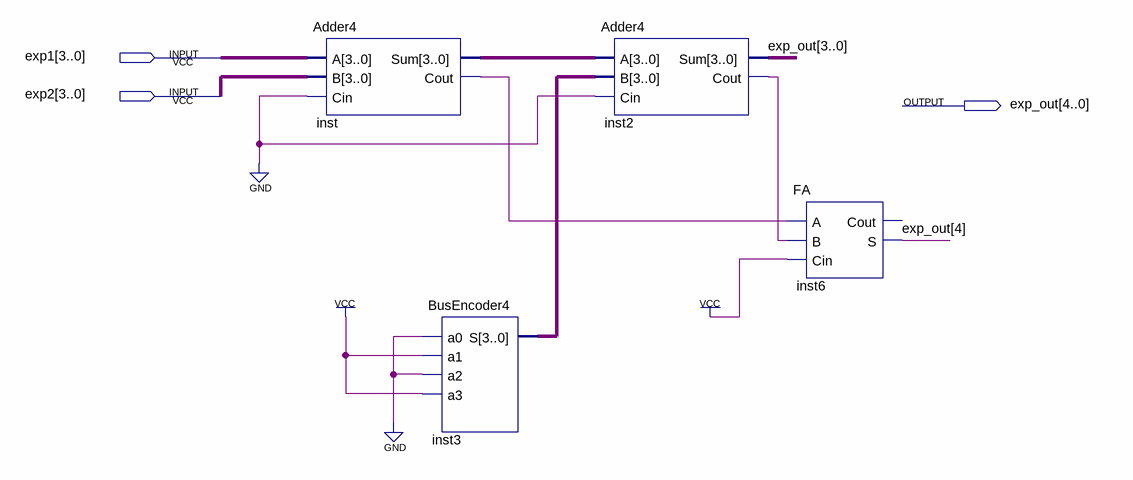
[diagram p0: schematic sheet]
// Quartus schematic expCalculator.bdf as structural Verilog: 4 symbols, 3 pins
module expCalculator (
  input  [3:0] exp1,
  input  [3:0] exp2,
  output [4:0] exp_out
);

  wire inst2_cout, inst_cout;
  wire [3:0] inst3_s, inst_sum;

  Adder4 inst (.A(exp1), .B(exp2), .Cin(1'b0), .Sum(inst_sum), .Cout(inst_cout));
  BusEncoder4 inst3 (.a0(1'b0), .a1(1'b1), .a2(1'b0), .a3(1'b1), .S(inst3_s));
  Adder4 inst2 (.A(inst_sum), .B(inst3_s), .Cin(1'b0), .Sum(exp_out[3:0]), .Cout(inst2_cout));
  FA inst6 (.A(inst_cout), .B(inst2_cout), .Cin(1'b1), .S(exp_out[4]));  // open: Cout
endmodule
